# EAGLE design Moodlight19_ETP1 (EAGLE 9.5.0)

## Sheet 1 of 2
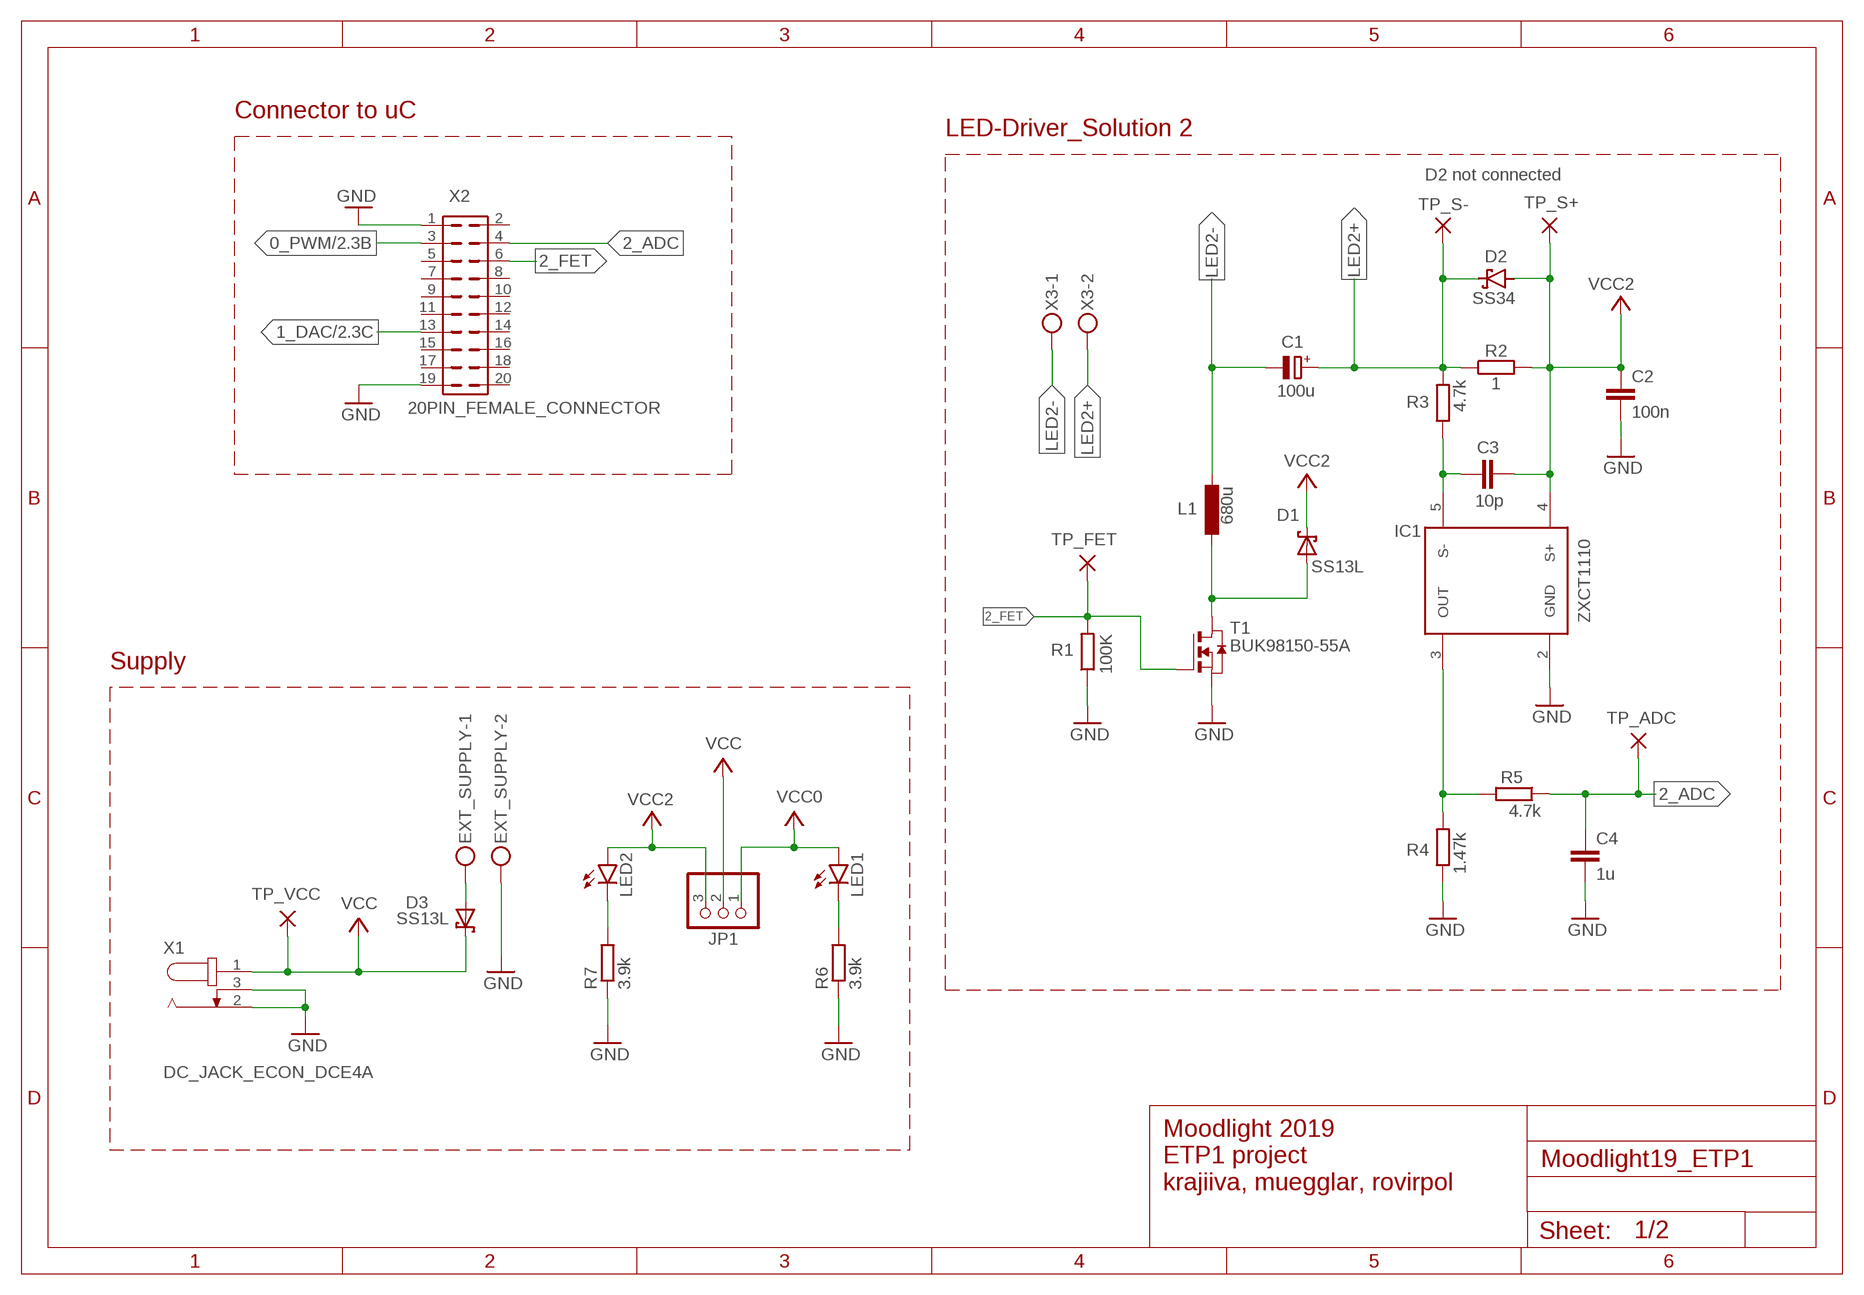
[diagram p0: schematic, sheet 1]

### Parts
C1  100u  CPOL-EUE3.5-8  [E3,5-8]
C2  100n  C-EUC0805K  [C0805K]
C3  10p  C-EUC0805K  [C0805K]
C4  1u  C-EUC0805K  [C0805K]
D1  SS13L  [SUB-SMA]
D2  SS34  SCHOTTKY-DIODESMC  [SMC]
D3  SS13L  [SUB-SMA]
EXT_SUPPLY  MKDSN1,5/2-5,08  [MKDSN1,5/2-5,08]
IC1  ZXCT1110  [SOT23-5]
JP1  PINHD-1X3  [1X03]
L1  680u  POWER-CHOKE_WE-PD  [POWER-CHOKE_WE-PD]
LED1  LED3MM  [LED3MM]
LED2  LED3MM  [LED3MM]
R1  100K  R-EU_R0805  [R0805]
R2  1  R-EU_R1206  [R1206]
R3  4.7k  R-EU_R0805  [R0805]
R4  1.47k  R-EU_R0805  [R0805]
R5  4.7k  R-EU_R0805  [R0805]
R6  3.9k  R-EU_R0805  [R0805]
R7  3.9k  R-EU_R0805  [R0805]
T1  BUK98150-55A  [SOT223]
TP_ADC  WIREPAD4,16O1,6  [4,16O1,6]
TP_FET  WIREPAD4,16O1,6  [4,16O1,6]
TP_S+  WIREPAD4,16O1,6  [4,16O1,6]
TP_S-  WIREPAD4,16O1,6  [4,16O1,6]
TP_VCC  WIREPAD4,16O1,6  [4,16O1,6]
X1  DC_JACK_ECON_DCE4A  [DC_JACK_ECON_DCE4A]
X2  20PIN_FEMALE_CONNECTOR  [20PIN_FEMALE_CONNECTOR]
X3  MKDSN1,5/2-5,08  [MKDSN1,5/2-5,08]

### Nets
0_PWM: X2.3 ; also sheet 2
1_DAC: X2.13 ; also sheet 2
2_ADC: C4.1 R5.1 TP_ADC.1(P) X2.4
2_FET: R1.2 T1.1(G) TP_FET.1(P) X2.6
A: D3.A EXT_SUPPLY.1
GND: C2.2 C4.2 EXT_SUPPLY.2 IC1.2(GND) R1.1 R4.1 R6.1 R7.1 T1.3(S) X1.2 X1.3 X2.1 X2.19 ; also sheet 2
LED2+: C1.+ D2.C R2.1 R3.2 TP_S-.1(P) X3.2
LED2-: C1.- L1.1 X3.1
N$1: LED1.K(C) R6.2
N$2: LED2.K(C) R7.2
N$4: IC1.3(OUT) R4.2 R5.2
N$6: C3.1 IC1.5(S-) R3.1
N$165: D1.A L1.2 T1.2(D) T1.4(D)
VCC: D3.C JP1.2 TP_VCC.1(P) X1.1 ; supply symbol labelled VCC2
VCC0: JP1.1 LED1.A ; supply symbol labelled VCC ; also sheet 2
VCC2: C2.1 C3.2 D1.C D2.A IC1.4(S+) JP1.3 LED2.A R2.2 TP_S+.1(P) ; supply symbol labelled VCC
Unconnected: X2.2 X2.5 X2.7 X2.8 X2.9 X2.10 X2.11 X2.12 X2.14 X2.15 X2.16 X2.17 X2.18 X2.20

### Notes on the sheet
- Connector to uC
- LED-Driver_Solution 2
- D2 not connected
- Supply
- Moodlight 2019
  ETP1 project 
  krajiiva, muegglar, rovirpol

## Sheet 2 of 2
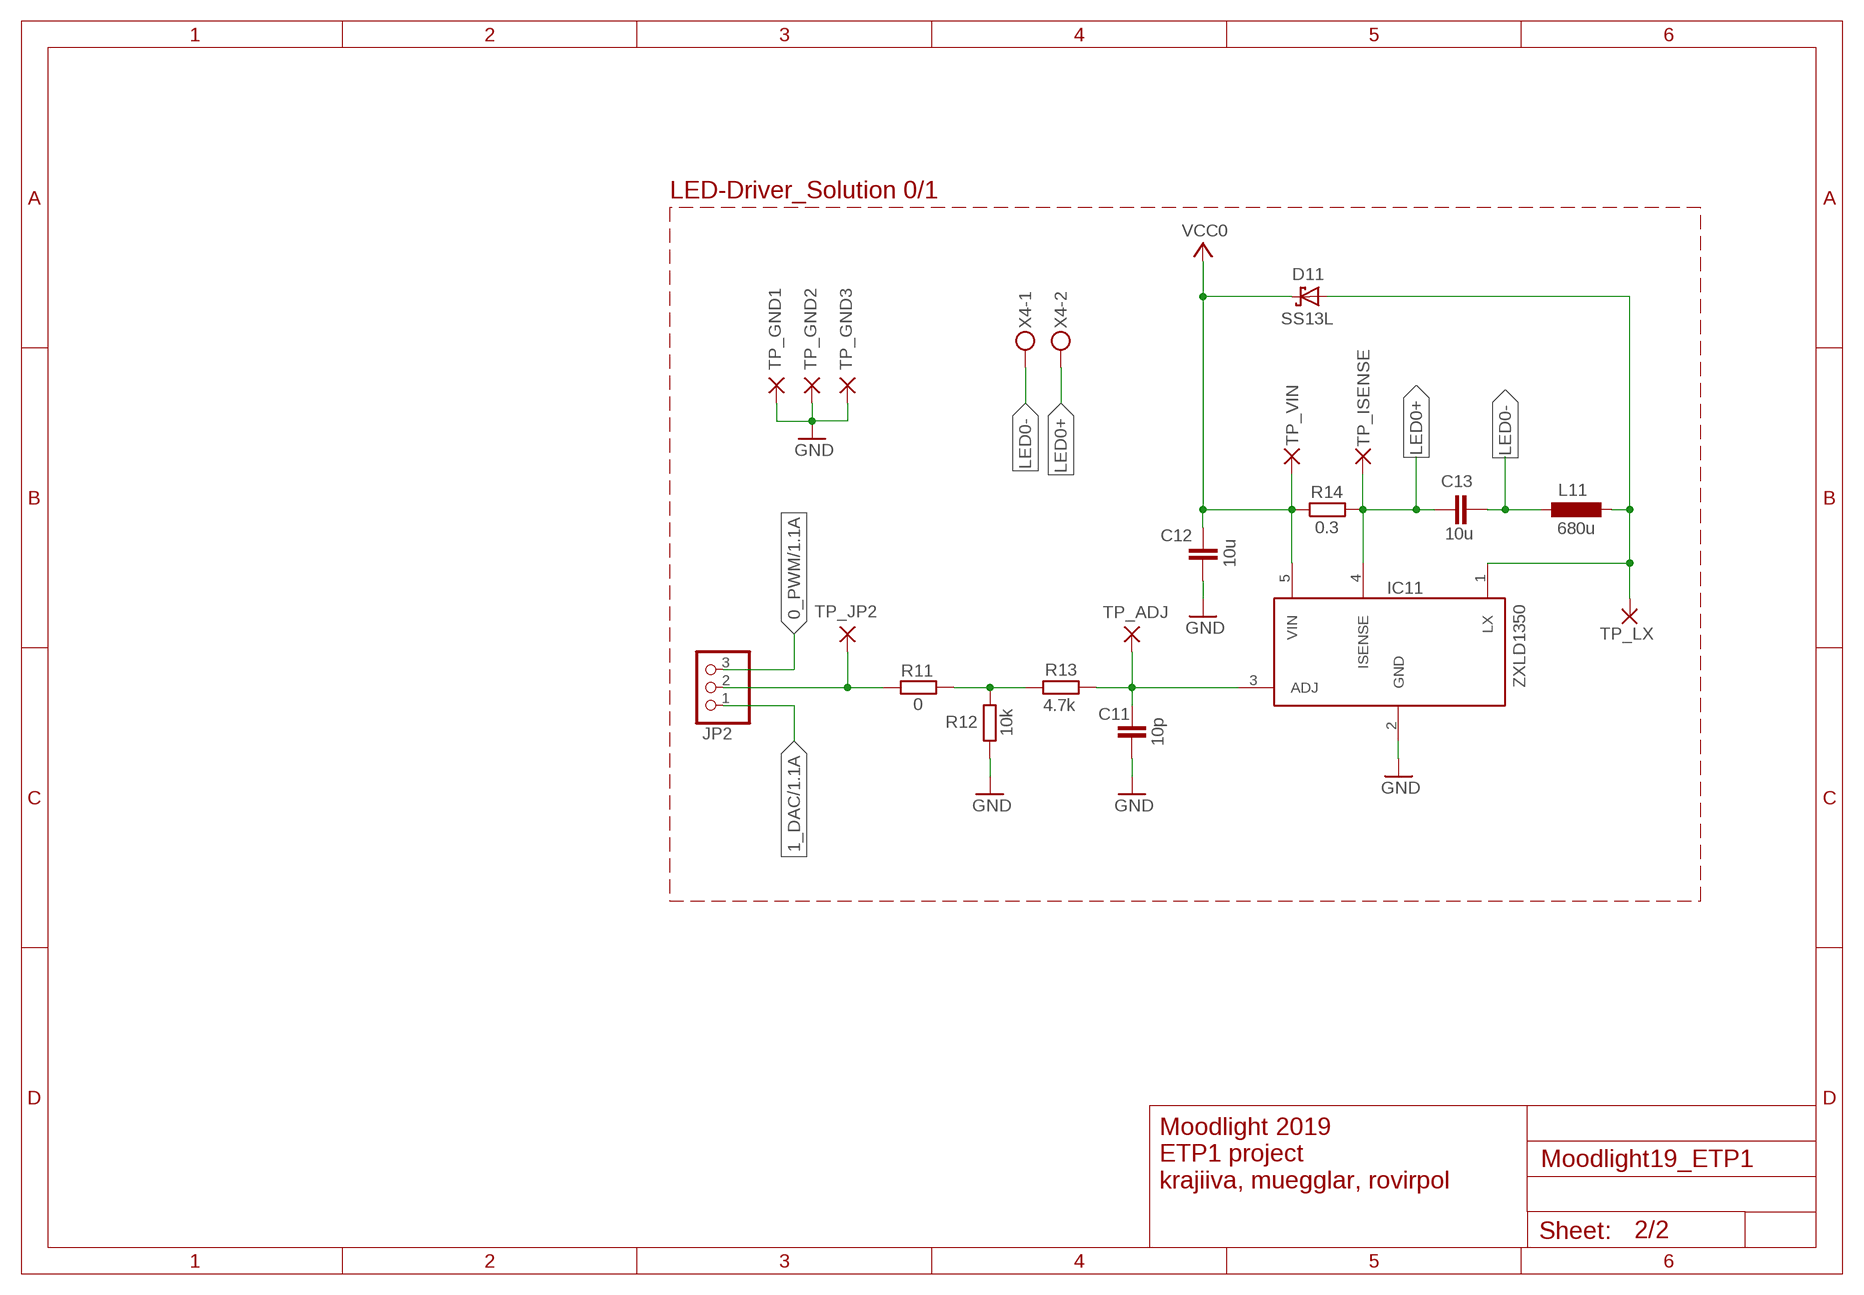
[diagram p1: schematic, sheet 2]

### Parts
C11  10p  C-EUC0805K  [C0805K]
C12  10u  C-EUC0805K  [C0805K]
C13  10u  C-EUC0805K  [C0805K]
D11  SS13L  [SUB-SMA]
IC11  ZXLD1350  [TSOT23-5L]
JP2  PINHD-1X3  [1X03]
L11  680u  POWER-CHOKE_WE-PD  [POWER-CHOKE_WE-PD]
R11  0  R-EU_R0805  [R0805]
R12  10k  R-EU_R0805  [R0805]
R13  4.7k  R-EU_R0805  [R0805]
R14  0.3  R-EU_R1206  [R1206]
TP_ADJ  WIREPAD4,16O1,6  [4,16O1,6]
TP_GND1  WIREPAD4,16O1,6  [4,16O1,6]
TP_GND2  WIREPAD4,16O1,6  [4,16O1,6]
TP_GND3  WIREPAD4,16O1,6  [4,16O1,6]
TP_ISENSE  WIREPAD4,16O1,6  [4,16O1,6]
TP_JP2  WIREPAD4,16O1,6  [4,16O1,6]
TP_LX  WIREPAD4,16O1,6  [4,16O1,6]
TP_VIN  WIREPAD4,16O1,6  [4,16O1,6]
X4  MKDSN1,5/2-5,08  [MKDSN1,5/2-5,08]

### Nets
0_ADJUST: JP2.2 R11.1 TP_JP2.1(P)
0_PWM: JP2.3 ; also sheet 1
1_DAC: JP2.1 ; also sheet 1
GND: C11.2 C12.2 IC11.2(GND) R12.1 TP_GND1.1(P) TP_GND2.1(P) TP_GND3.1(P) ; also sheet 1
LED0+: C13.1 IC11.4(ISENSE) R14.2 TP_ISENSE.1(P) X4.2
LED0-: C13.2 L11.1 X4.1
N$3: R11.2 R12.2 R13.2
N$8: D11.A IC11.1(LX) L11.2 TP_LX.1(P)
N$9: C11.1 IC11.3(ADJ) R13.1 TP_ADJ.1(P)
VCC0: C12.1 D11.C IC11.5(VIN) R14.1 TP_VIN.1(P) ; also sheet 1

### Notes on the sheet
- LED-Driver_Solution 0/1
- Moodlight 2019
  ETP1 project 
  krajiiva, muegglar, rovirpol

## Library data of the parts
C1 = rcl:CPOL-EU: POLARIZED CAPACITOR, European symbol; SPICEPREFIX: C
C2-C4 C11-C13 = rcl:C-EU: CAPACITOR, European symbol; SPICEPREFIX: C
D1 D3 D11 = Moodlight:SS13L: Schottky-Diode 1A/30V
D2 = diode:SCHOTTKY-DIODE: Schottky Diode
EXT_SUPPLY X3 X4 = con-phoenix-508:MKDSN1,5/2-5,08: MKDSN 1,5/ 2-5,08 Printklemme Nennstrom: 13,5 A Nennspannung: 250 V Rastermaß: 5,08 mm Polzahl: 2 Anschlussart: Schraubanschluss Montage: Löten Anschlussrichtung Leiter/Platine: 0 ° Artikelnummer: 1729128 Source: http://eshop.phoenixcontact.com .. 1729128.pdf
IC1 = Moodlight:ZXCT1110: ZXCT1110 LOW POWER HIGH-SIDE CURRENT MONITOR
IC11 = Moodlight:ZXLD1350: ZXLD1350 30V 350mA LED DRIVER with AEC-Q100
JP1 JP2 = pinhead:PINHD-1X3: PIN HEADER
L1 L11 = Moodlight:POWER-CHOKE_WE-PD: POWER-CHOKE_WE-PD
LED1 LED2 = led:LED: LED OSRAM: - CHIPLED LG R971, LG N971, LY N971, LG Q971, LY Q971, LO R971, LY R971 LH N974, LH R974 LS Q976, LO Q976, LY Q976 LO Q996 - Hyper CHIPLED LW Q18S LB Q993, LB Q99A, LB R99A - SideLED LS A670, LO A670, LY A670, LG A670, LP A670 LB A673, LV A673, LT A673, LW A673 LH A674 LY A675 LS A676, LA A676, LO A676, LY A676, LW A676 LS A679, LY A679, LG A679 - Hyper Micro SIDELED® LS Y876, LA Y876, LO Y876, LY Y876 LT Y87S - SmartLED LW L88C, LW L88S LB L89C, LB L89S, LG L890 LS L89K, LO L89K, LY L89K LS L896, LA L896, LO L896, LY L896 - TOPLED LS T670, LO T670, LY T670, LG T670, LP T670 LSG T670, LSP T670, LSY T670, LOP T670, LYG T670 LG T671, LOG T671, LSG T671 LB T673, LV T673, LT T673, LW T673 LH T674 LS T676, LA T676, LO T676, LY T676, LB T676, LH T676, LSB T676, LW T676 LB T67C, LV T67C, LT T67C, LS T67K, LO T67K, LY T67K, LW E67C LS E67B, LA E67B, LO E67B, LY E67B, LB E67C, LV E67C, LT E67C LW T67C LS T679, LY T679, LG T679 LS T770, LO T770, LY T770, LG T770, LP T770 LB T773, LV T773, LT T773, LW T773 LH T774 LS E675, LA E675, LY E675, LS T675 LS T776, LA T776, LO T776, LY T776, LB T776 LHGB T686 LT T68C, LB T68C - Hyper Mini TOPLED® LB M676 - Mini TOPLED Santana® LG M470 LS M47K, LO M47K, LY M47K Source: http://www.osram.convergy.de LUXEON: - LUMILED® LXK2-PW12-R00, LXK2-PW12-S00, LXK2-PW14-U00, LXK2-PW14-V00 LXK2-PM12-R00, LXK2-PM12-S00, LXK2-PM14-U00 LXK2-PE12-Q00, LXK2-PE12-R00, LXK2-PE12-S00, LXK2-PE14-T00, LXK2-PE14-U00 LXK2-PB12-K00, LXK2-PB12-L00, LXK2-PB12-M00, LXK2-PB14-N00, LXK2-PB14-P00, LXK2-PB14-Q00 LXK2-PR12-L00, LXK2-PR12-M00, LXK2-PR14-Q00, LXK2-PR14-R00 LXK2-PD12-Q00, LXK2-PD12-R00, LXK2-PD12-S00 LXK2-PH12-R00, LXK2-PH12-S00 LXK2-PL12-P00, LXK2-PL12-Q00, LXK2-PL12-R00 Source: www.luxeon.com KINGBRIGHT: KA-3528ASYC Source: www.kingbright.com
R1-R7 R11-R14 = rcl:R-EU_: RESISTOR, European symbol; SPICEPREFIX: R
T1 = Moodlight:BUK98150-55A: n-Kanal-MOS-FET; OC_FARNELL: unknown; OC_NEWARK: unknown
TP_ADC TP_ADJ TP_FET TP_GND1-TP_GND3 TP_ISENSE TP_JP2 TP_LX TP_S+ TP_S- TP_VCC TP_VIN = wirepad:WIREPAD: Wire PAD connect wire on PCB
X1 = Moodlight:DC_JACK_ECON_DCE4A: DC_JACK_ECON_DCE4A
X2 = Moodlight:20PIN_FEMALE_CONNECTOR: Buchsenleiste 20Pol 90°

## Board
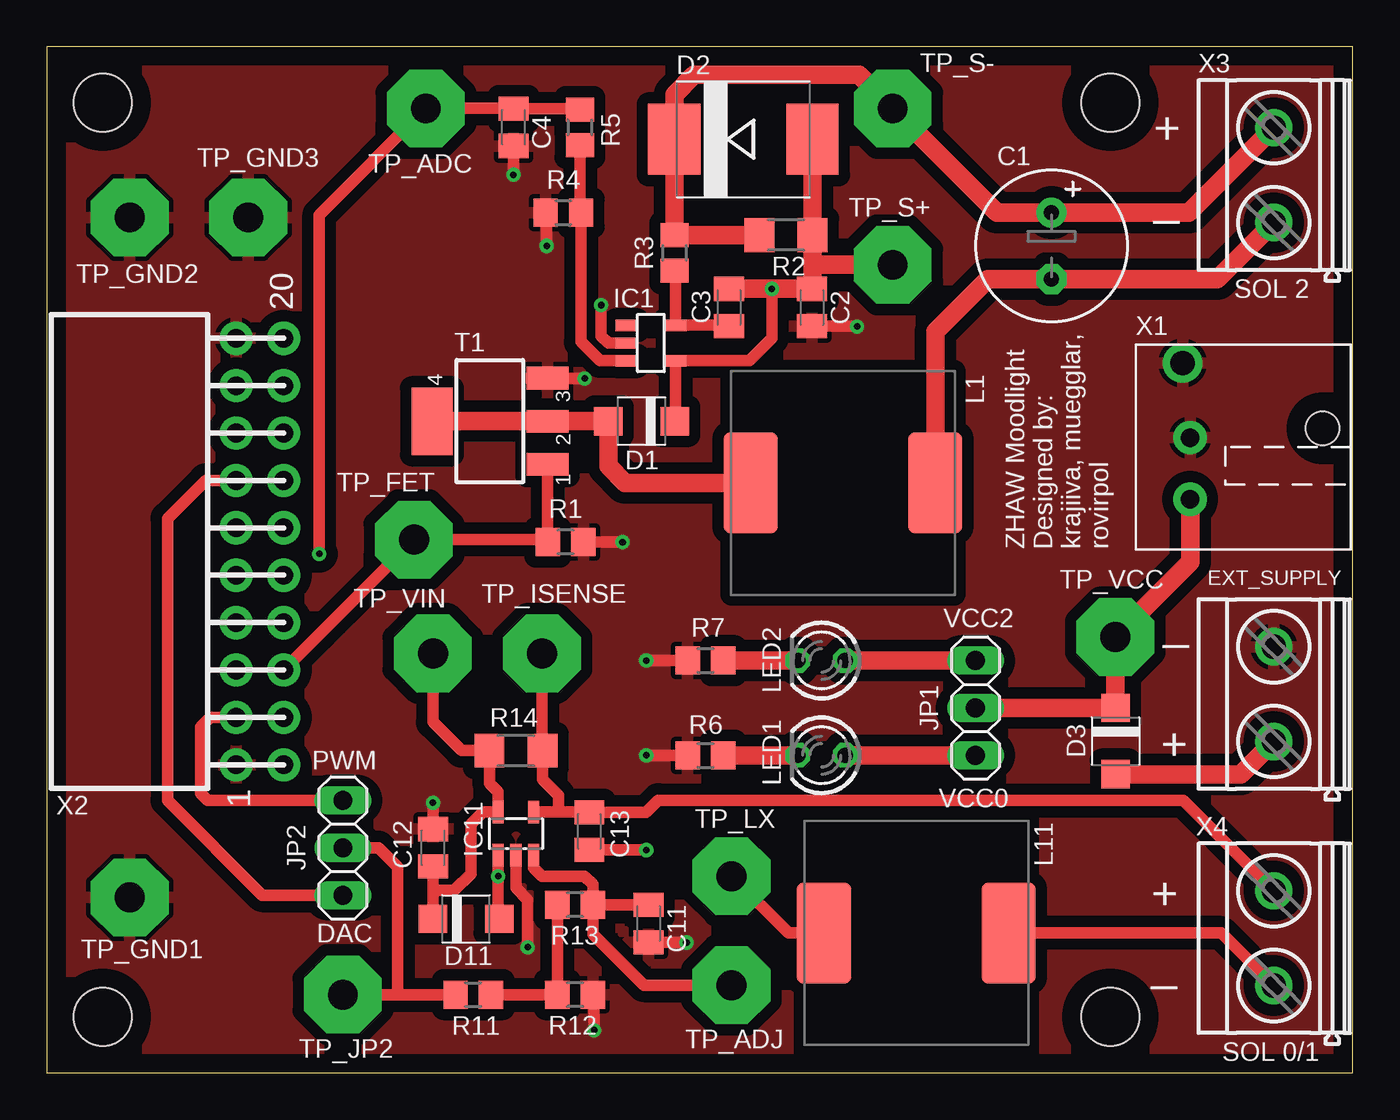
[diagram p2: board, top side]
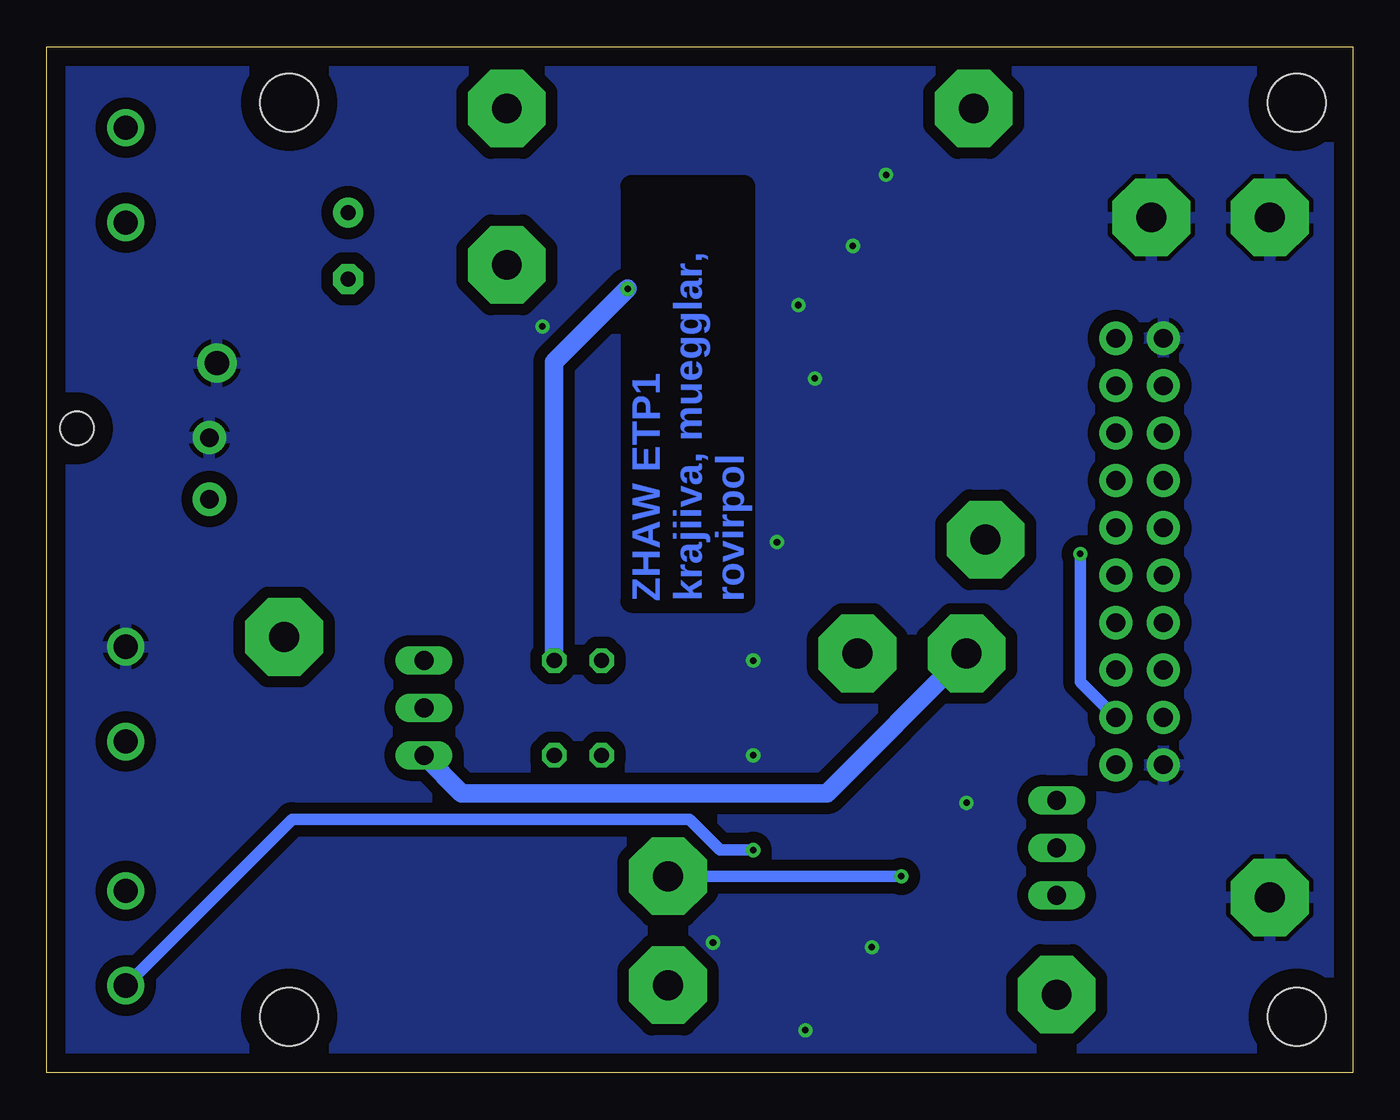
[diagram p3: board, bottom side, seen from below]

Size 70 x 55 mm. Coordinates in mm from the lower left corner, seen from the top.
Outline: 0,0 70,0 70,55 0,55 0,0
Copper layers (1*16): Top 0.035mm / dielectric 1.5mm / Bottom 0.035mm
Design rules "default": minimum track width 6mil, minimum drill 0.35mm, track to track 6mil, track to pad 6mil, pad to pad 6mil, via to via 6mil, smd to smd 6mil, copper to edge 40mil, drill to drill 6mil, minimum pad ring 10mil, minimum via ring 8mil, stop-mask expansion 4mil, vias tented up to drill 0mil, thermal gap 10mil
Holes 3.1 mm at 3,52 3,3 57,3 57,52
bKeepout: area 0,0 to 6,6
tRestrict: area 36.7,25.7 to 48.6,37.6; area 40.6,1.5 to 52.6,13.5
bRestrict: area 35.6,32.4 to 36.7,33.4

### Footprints (pad centres in the part's own frame; a part is rotated, then mirrored left to right if it is on the bottom)
E3,5-8 = drill 0.813 pad 1.6: + -1.778,0 | drill 0.813 pad 1.6 octagon: - 1.778,0
C0805K = smd 1.3 x 1.6: 1 -1,0; 2 1,0
SUB-SMA = smd 1.524 x 1.524: A 1.778,0; C -1.778,0
SMC = smd 2.8 x 3.8: A 3.7,0; C -3.7,0
MKDSN1,5/2-5,08 = drill 1.3 pad 2: 1 -2.561,0.025; 2 2.519,0.025
SOT23-5 = smd 0.6 x 1.2: 1 -0.95,-1.306; 2 0,-1.306; 3 0.95,-1.306; 4 0.95,1.306; 5 -0.95,1.306
TSOT23-5L = smd 0.6 x 1.2: 1 -0.95,-1.15; 2 0,-1.15; 3 0.95,-1.15; 4 0.95,1.15; 5 -0.95,1.15
1X03 = drill 1.016 long: 1 -2.54,0; 2 0,0; 3 2.54,0
POWER-CHOKE_WE-PD = smd 5.4 x 2.9: 1 0,4.95; 2 0,-4.95
LED3MM = drill 0.813 octagon: A -1.27,0; K 1.27,0
R0805 = smd 1.3 x 1.5: 1 -0.95,0; 2 0.95,0
R1206 = smd 1.6 x 1.803: 1 -1.422,0; 2 1.422,0
SOT223 = smd 1.219 x 2.235: 1 -2.311,-3.099; 2 0,-3.099; 3 2.311,-3.099 | smd 3.6 x 2.2: 4 0,3.099
4,16O1,6 = drill 1.6 pad 4.166 octagon: 1 0,0
DC_JACK_ECON_DCE4A = drill 1 pad 1.778: 1 0,3.8; 3 0,0.5 | drill 1.3 pad 2.1: 2 0.4,-3.5 | hole 1.8: -7.1,0
20PIN_FEMALE_CONNECTOR = drill 1 pad 1.778: 1 -8.89,1.27; 2 -8.89,-1.27; 3 -6.35,1.27; 4 -6.35,-1.27; 5 -3.81,1.27; 6 -3.81,-1.27; 7 -1.27,1.27; 8 -1.27,-1.27; 9 1.27,1.27; 10 1.27,-1.27; 11 3.81,1.27; 12 3.81,-1.27; 13 6.35,1.27; 14 6.35,-1.27; 15 8.89,1.27; 16 8.89,-1.27; 17 11.43,1.27; 18 11.43,-1.27; 19 13.97,1.27; 20 13.97,-1.27

### Placement (x,y rotation side)
C1  53.85,44.32 270 top
C2  41.02,41.02 270 top
C3  36.58,41.02 90 top
C4  25.02,50.67 270 top
C11  32.26,8 270 top
C12  20.7,12.06 90 top
C13  29.08,12.95 270 top
D1  31.88,34.92 180 top
D2  37.34,50.04 0 top
D3  57.28,17.78 270 top
D11  22.48,8.26 0 top
EXT_SUPPLY  65.79,20.32 90 top
IC1  32.38,39.12 270 top
IC11  25.15,12.83 0 top
JP1  49.78,19.56 90 top
JP2  15.88,12.06 90 top
L1  42.67,31.62 270 top
L11  46.61,7.49 270 top
LED1  41.53,17.02 180 top
LED2  41.53,22.1 180 top
R1  27.81,28.45 180 top
R2  39.62,44.89 0 top
R3  33.66,43.94 90 top
R4  27.69,46.1 0 top
R5  28.57,50.67 270 top
R6  35.31,17.02 0 top
R7  35.31,22.1 0 top
R11  22.86,4.19 0 top
R12  28.32,4.19 180 top
R13  28.32,9.02 180 top
R14  25.15,17.27 0 top
T1  23.75,34.92 90 top
TP_ADC  20.32,51.69 0 top
TP_ADJ  36.7,4.7 0 top
TP_FET  19.68,28.57 0 top
TP_GND1  4.45,9.4 270 top
TP_GND2  4.45,45.85 270 top
TP_GND3  10.79,45.85 270 top
TP_ISENSE  26.54,22.48 0 top
TP_JP2  15.88,4.19 0 top
TP_LX  36.7,10.54 0 top
TP_S+  45.34,43.31 0 top
TP_S-  45.34,51.69 0 top
TP_VCC  57.28,23.37 0 top
TP_VIN  20.7,22.48 0 top
X1  61.28,34.54 180 top
X2  11.43,25.4 90 top
X3  65.79,48.13 90 top
X4  65.79,7.24 90 top

### Tracks (layer width: path | path; a pad name or v marks a point on that pad's centre or on a via)
0_ADJUST
  Top 0.61: TP_JP2.1 18.8,4.19 | 18.8,4.19 R11.1 | JP2.2 17.78,12.06 18.8,11.05 18.8,4.19
0_PWM
  Top 0.61: X2.3 8.76,19.05 8.26,18.54 8.26,14.99 8.64,14.61 JP2.3
1_DAC
  Top 0.61: X2.13 8.51,31.75 6.48,29.72 6.48,14.61 11.56,9.53 JP2.1
2_ADC  (via drill 0.35)
  Top 0.61: R5.1 28.52,51.67 C4.1 25,51.69 TP_ADC.1 14.61,45.97 v14.61,27.81
  Bottom 0.61: X2.4 14.61,20.95 v14.61,27.81
2_FET
  Top 0.61: T1.1 26.85,28.46 R1.2 26.74,28.57 TP_FET.1 X2.6
A
  Top 1: EXT_SUPPLY.1 64,16 D3.A
GND  (via drill 0.35)
  Top 0.61: R7.1 v32.13,22.1 | IC1.2 30.1,39.12 29.72,39.5 v29.72,41.15 | R4.1 26.8,46.04 v26.8,44.32 | C4.2 v25.02,48.13 | C2.2 43.42,40.02 v43.43,40.01 | C11.2 34.27,7 v34.29,6.99 | R6.1 v32.13,17.02 | C12.2 v20.7,14.48 | R12.1 29.34,4.12 v29.34,2.29 | v25.78,6.73 25.78,9.27 25.15,9.91 IC11.2 | R1.1 v30.86,28.45 | T1.3 26.87,37.21 v28.83,37.21
  pour Bottom (isolate 0.61): -0.51,55.37 -0.51,-0.38 0,-0.89 70.48,-0.89 70.74,-0.64 70.74,55.5 70.1,56.13 0.25,56.13
  pour Top (isolate 0.61): -1.4,55.63 -1.4,-0.76 -0.25,-1.91 70.99,-1.91 72.77,-0.13 72.77,54.99 70.48,57.28 0.25,57.28
LED0+
  Top 0.61: IC11.4 27.43,13.98 | 27.43,13.98 29.06,13.98 29.07,13.97 | 29.07,13.97 C13.1 | 27.43,13.98 27.43,14.86 26.57,15.72 R14.2 26.54,17.3 TP_ISENSE.1 | 29.07,13.97 32.13,13.97 32.77,14.61 60.91,14.61 X4.2
LED0-  (via drill 0.35)
  Top 0.61: C13.2 32.12,11.95 v32.13,11.94 | X4.1 62.95,7.49 L11.1
  Bottom 0.61: v32.13,11.94 33.91,11.94 35.56,13.59 56.85,13.59 X4.1
LED2+
  Top 0.61: 33.66,50.02 D2.C
  Top 1: 33.66,50.02 R3.2 R2.1 | D2.C 33.64,52.43 34.69,53.48 43.54,53.48 TP_S-.1 50.93,46.1 C1.+ 61.21,46.1 X3.2
LED2-
  Top 1: L1.1 47.62,39.73 50.44,42.55 C1.- 62.73,42.55 X3.1
N$1
  Top 1: LED1.K R6.2
N$2
  Top 1: LED2.K R7.2
N$3
  Top 0.61: R11.2 R12.2 R13.2
N$4
  Top 0.61: R5.2 28.57,46.16 R4.2 28.64,39.18 29.65,38.17 IC1.3
N$6
  Top 0.61: R3.1 33.69,42.96 IC1.5 36.53,40.07 C3.1
N$8  (via drill 0.35)
  Top 0.61: D11.A 24.2,8.32 v24.2,10.54 IC11.1 | L11.2 39.75,7.49 TP_LX.1
  Bottom 0.61: TP_LX.1 v24.2,10.54
N$9
  Top 0.61: R13.1 32.24,9.02 C11.1 | R13.1 29.27,10.1 28.83,10.54 26.54,10.54 26.1,10.99 IC11.3 | R13.1 29.27,7.43 32,4.7 TP_ADJ.1
N$165
  Top 1: L1.2 30.99,31.62 30.1,32.51 D1.A T1.2 T1.4
VCC
  Top 1: JP1.2 D3.C TP_VCC.1 61.28,27.37 X1.1
VCC0
  Top 0.61: C12.1 20.7,9.78 | 20.7,9.78 D11.C | 20.7,9.78 21.84,9.78 22.73,10.67 22.73,13.34 23.38,13.98 IC11.5 24.2,15.05 23.72,15.52 R14.1 22.23,17.27 20.7,18.8 TP_VIN.1
  Top 1: JP1.1 LED1.A
  Bottom 1: JP1.1 47.75,14.99 28.19,14.99 TP_VIN.1
VCC2  (via drill 0.35)
  Top 0.61: D1.C 33.69,34.96 IC1.4 37.66,38.17 38.86,39.37 v38.86,42.02
  Top 1: D2.A 41.04,44.9 R2.2 41.05,43.31 | 41.05,43.31 41.05,42.05 C2.1 v38.86,42.02 C3.2 | TP_S+.1 41.05,43.31 | JP1.3 LED2.A
  Bottom 1: LED2.A 42.8,38.08 v38.86,42.02

### Text on the board
Bottom: ZHAW ETP1 / krajiiva, muegglar, / rovirpol
tNames: + | _ | SOL 2 | ZHAW Moodlight / Designed by: / krajiiva, muegglar, / rovirpol | VCC2 | _ | + | PWM | VCC0 | + | DAC | _ | SOL 0/1